# EAGLE schematic vista_air_beta_1 (EAGLE 7.7.0)
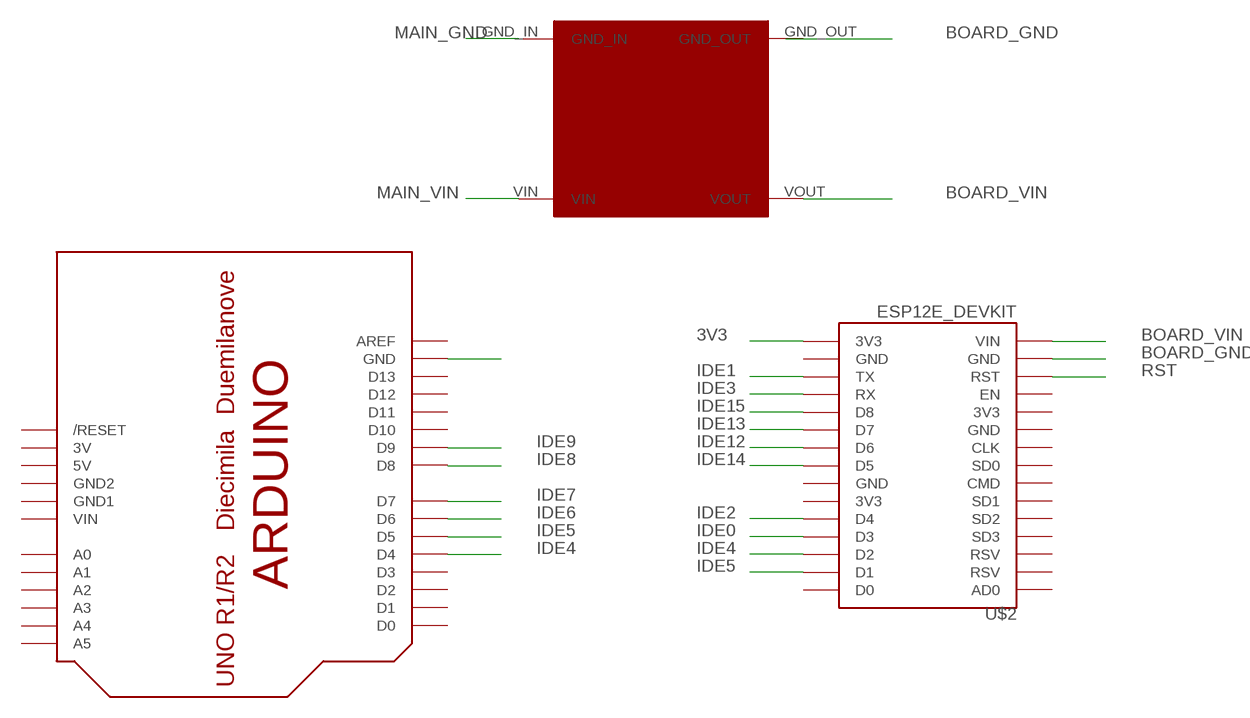
[diagram p0: schematic, sheet 1]

## Parts
U$1  ARDUINOUNO  [ARDUINO]
U$2  ESP12E_DEVKIT  [ESP12E_DEVKIT]
U$3  MP1584EN_STEPDOWN_MODULE  [MP1584EN_STEPDOWN_MODULE]

## Nets
3V3: U$2.3V3@2(3V3)
BOARD_GND: U$1.GND U$2.GND@1(GND)
BOARD_VIN: U$2.VIN U$3.VOUT
IDE0: U$2.D3
IDE1: U$2.TX
IDE2: U$2.D4
IDE3: U$2.RX
IDE4: U$1.D4 U$2.D2
IDE5: U$1.D5 U$2.D1
IDE6: U$1.D6
IDE7: U$1.D7
IDE8: U$1.D8
IDE9: U$1.D9
IDE12: U$2.D6
IDE13: U$2.D7
IDE14: U$2.D5
IDE15: U$2.D8
MAIN_GND: U$3.GND_IN
MAIN_VIN: U$3.VIN
RST: U$2.RST
Unconnected: U$1.A0 U$1.A1 U$1.A2 U$1.A3 U$1.A4 U$1.A5 U$1.AREF U$1.D0 U$1.D1 U$1.D2 U$1.D3 U$1.D10 U$1.D11 U$1.D12 U$1.D13 U$1.RESET(/RESET) U$2.3V3@0(3V3) U$2.3V3@1(3V3) U$2.AD0 U$2.CLK U$2.CMD U$2.D0 U$2.EN U$2.GND@0(GND) U$2.GND@2(GND) U$2.GND@3(GND) U$2.RSV@0(RSV) U$2.RSV@1(RSV) U$2.SD0 U$2.SD1 U$2.SD2 U$2.SD3 U$3.GND_OUT

## Power pins joined to a net without a drawn wire
3V: U$1.3V
5V: U$1.5V
GND1: U$1.GND1
GND2: U$1.GND2
VIN: U$1.VIN

## Library data of the parts
U$1 = adafruit:ARDUINO: Arduino Diecimila/Duemilanove Make a shield with ease, this package has all the named pins as well as the two mounting drill holes and an outline of the USB and DC power connector. The outline is on the DIMENSION layer, so if your board house uses it they will cut the outline to match. http://www.ladyada.net/library/pcb/eaglelibrary.html
U$2 = ESP12E_DEVKIT:ESP12E_DEVKIT: ESP12E DEVKIT BOARD
U$3 = kevins_parts:MP1584EN_STEPDOWN_MODULE

## Net classes
0 default: width 0.508 mm, clearance 0.508 mm
1 power: width 1.778 mm, clearance 1.27 mm